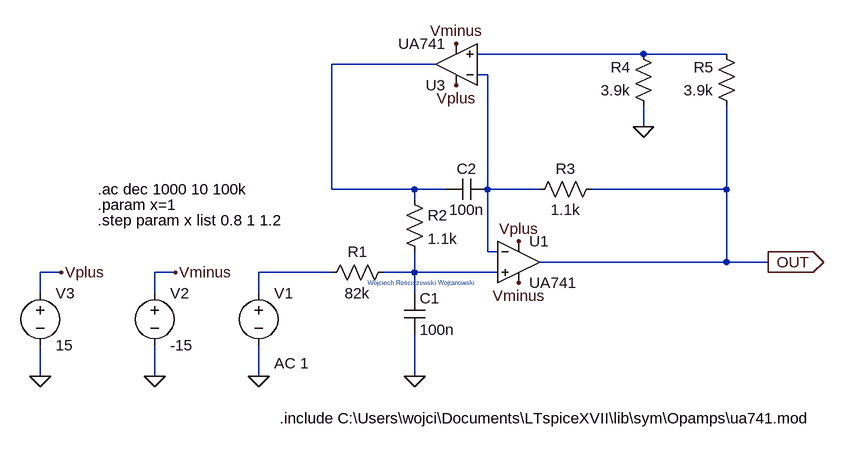
[diagram p0: schematic Homework.asc]
Homework.asc, the LTspice schematic file:
Version 4
SHEET 1 1800 680
WIRE 768 -384 512 -384
WIRE 896 -384 768 -384
WIRE 448 -368 288 -368
WIRE 528 -352 512 -352
WIRE 768 -272 768 -304
WIRE 288 -176 288 -368
WIRE 416 -176 288 -176
WIRE 464 -176 416 -176
WIRE 528 -176 528 -352
WIRE 608 -176 528 -176
WIRE 896 -176 896 -304
WIRE 896 -176 688 -176
WIRE 416 -160 416 -176
WIRE 528 -80 528 -176
WIRE 544 -80 528 -80
WIRE 896 -64 896 -176
WIRE 896 -64 608 -64
WIRE 960 -64 896 -64
WIRE -128 -48 -160 -48
WIRE 48 -48 16 -48
WIRE 288 -48 176 -48
WIRE 416 -48 416 -80
WIRE 416 -48 368 -48
WIRE 544 -48 416 -48
WIRE -160 -16 -160 -48
WIRE 16 -16 16 -48
WIRE 176 -16 176 -48
WIRE 416 -16 416 -48
WIRE -160 112 -160 64
WIRE 16 112 16 64
WIRE 176 112 176 64
WIRE 416 112 416 48
FLAG -160 112 0
FLAG 16 112 0
FLAG 176 112 0
FLAG 48 -48 Vminus
FLAG -128 -48 Vplus
FLAG 416 112 0
FLAG 768 -272 0
FLAG 960 -64 OUT
IOPIN 960 -64 Out
FLAG 576 -96 Vplus
FLAG 576 -32 Vminus
FLAG 480 -336 Vplus
FLAG 480 -400 Vminus
SYMBOL voltage 176 -32 R0
WINDOW 123 24 124 Left 2
WINDOW 39 0 0 Left 0
SYMATTR Value2 AC 1
SYMATTR InstName V1
SYMATTR Value ""
SYMBOL voltage 16 -32 R0
WINDOW 123 0 0 Left 0
WINDOW 39 0 0 Left 0
SYMATTR InstName V2
SYMATTR Value -15
SYMBOL voltage -160 -32 R0
WINDOW 123 0 0 Left 0
WINDOW 39 0 0 Left 0
SYMATTR InstName V3
SYMATTR Value 15
SYMBOL res 384 -64 R90
WINDOW 0 0 56 VBottom 2
WINDOW 3 32 56 VTop 2
SYMATTR InstName R1
SYMATTR Value 82k
SYMBOL cap 400 -16 R0
SYMATTR InstName C1
SYMATTR Value 100n
SYMBOL res 400 -176 R0
SYMATTR InstName R2
SYMATTR Value 1.1k
SYMBOL cap 528 -192 R90
WINDOW 0 0 32 VBottom 2
WINDOW 3 32 32 VTop 2
SYMATTR InstName C2
SYMATTR Value 100n
SYMBOL res 704 -192 R90
WINDOW 0 0 56 VBottom 2
WINDOW 3 32 56 VTop 2
SYMATTR InstName R3
SYMATTR Value 1.1k
SYMBOL res 784 -288 R180
WINDOW 0 36 76 Left 2
WINDOW 3 36 40 Left 2
SYMATTR InstName R4
SYMATTR Value 3.9k
SYMBOL res 912 -288 R180
WINDOW 0 36 76 Left 2
WINDOW 3 36 40 Left 2
SYMATTR InstName R5
SYMATTR Value 3.9k
SYMBOL Opamps\\opamp2 576 -128 R0
SYMATTR InstName U1
SYMATTR Value UA741
SYMBOL Opamps\\opamp2 480 -304 R180
SYMATTR InstName U3
SYMATTR Value UA741
TEXT 208 176 Left 2 !.include C:\\Users\\wojci\\Documents\\LTspiceXVII\\lib\\sym\\Opamps\\ua741.mod
TEXT 344 -32 Left 0 ;Wojciech Rościszewski Wojtanowski
TEXT -72 -176 Left 2 !.ac dec 1000 10 100k
TEXT -72 -152 Left 2 !.param x=1
TEXT -72 -128 Left 2 !.step param x list 0.8 1 1.2

The netlist it stands for:
* Homework.asc
V1 N004 0 AC 1
V2 Vminus 0 -15
V3 Vplus 0 15
R1 N005 N004 82k
C1 N005 0 100n
R2 N002 N005 1.1k
C2 N003 N002 100n
R3 OUT N003 1.1k
R4 0 N001 3.9k
R5 OUT N001 3.9k
XU1 N005 N003 Vplus Vminus OUT UA741  ; pins In+ In- V+ V- OUT
XU3 N001 N003 Vplus Vminus N002 UA741  ; pins In+ In- V+ V- OUT
.include C:\Users\wojci\Documents\LTspiceXVII\lib\sym\Opamps\ua741.mod
* Wojciech Rościszewski Wojtanowski
.ac dec 1000 10 100k
.param x=1
.step param x list 0.8 1 1.2
.backanno
.end